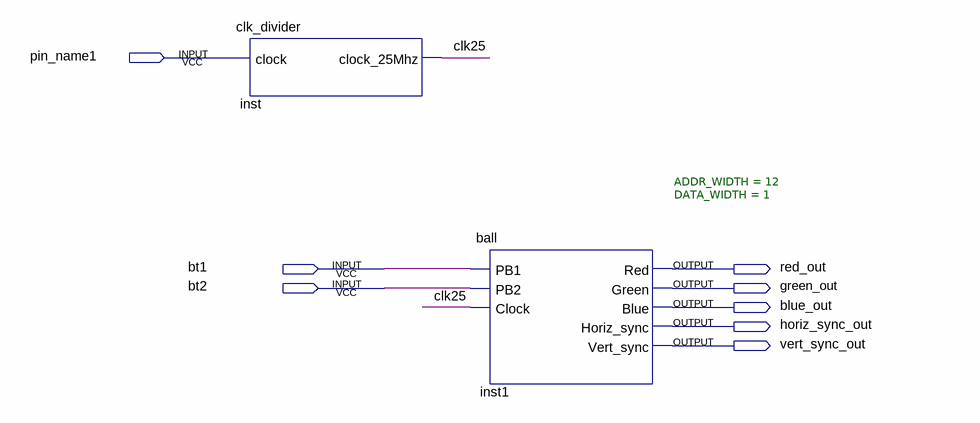
[diagram p0: schematic sheet]
// Quartus schematic ball_example.bdf as structural Verilog: 2 symbols, 8 pins
module ball_example (
  input  pin_name1,
  input  bt1,
  input  bt2,
  output red_out,
  output green_out,
  output blue_out,
  output horiz_sync_out,
  output vert_sync_out
);

  wire clk25;

  clk_divider inst (.clock(pin_name1), .clock_25Mhz(clk25));
  ball #(.ADDR_WIDTH(12), .DATA_WIDTH(1)) inst1 (
    .PB1(bt1), .PB2(bt2), .Clock(clk25), .Red(red_out), .Green(green_out), .Blue(blue_out),
    .Horiz_sync(horiz_sync_out), .Vert_sync(vert_sync_out));
endmodule
